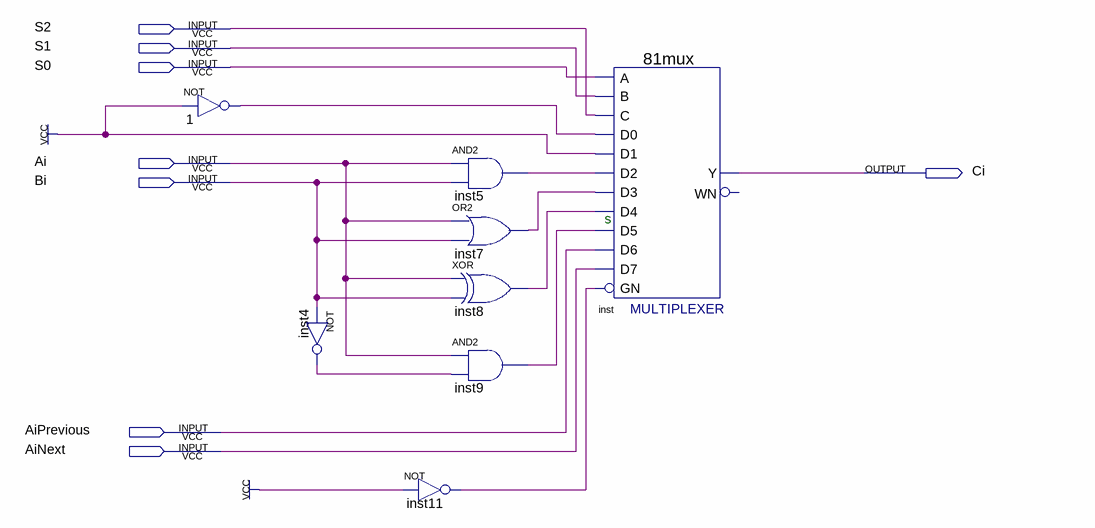
[diagram p0: schematic sheet]
// Quartus schematic logiccircuit1bit.bdf as structural Verilog: 8 symbols, 8 pins
module logiccircuit1bit (
  input  S2,
  input  S1,
  input  S0,
  input  Ai,
  input  Bi,
  input  AiPrevious,
  input  AiNext,
  output Ci
);

  wire inst4_out, inst5_out, inst7_out, inst8_out, inst9_out, inst11_out, n1_out;

  not u_1 (n1_out, 1'b1);
  not inst4 (inst4_out, Bi);
  not inst11 (inst11_out, 1'b1);
  and inst5 (inst5_out, Ai, Bi);
  or inst7 (inst7_out, Ai, Bi);
  xor inst8 (inst8_out, Ai, Bi);
  and inst9 (inst9_out, Ai, inst4_out);
  \81mux  inst (
    .C(S2), .D1(1'b1), .D0(n1_out), .D5(inst9_out), .D4(inst8_out), .D2(inst5_out), .D3(inst7_out),
    .GN(inst11_out), .D7(AiNext), .D6(AiPrevious), .A(S0), .B(S1), .Y(Ci));  // open: WN

  // Notes on the sheet:
  //   s
endmodule
